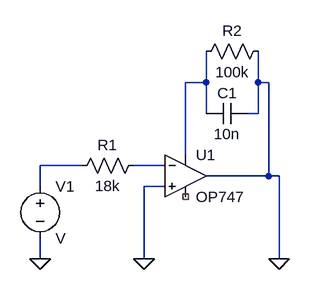
[diagram p0: schematic Draft1.asc]
Draft1.asc, the LTspice schematic file:
Version 4
SHEET 1 880 680
WIRE 480 -48 480 -96
WIRE 480 -48 448 -48
WIRE 560 -48 560 -96
WIRE 576 -48 560 -48
WIRE 480 0 480 -48
WIRE 560 0 560 -48
WIRE 560 0 544 0
WIRE 448 64 448 -48
WIRE 288 80 224 80
WIRE 416 80 368 80
WIRE 576 96 576 -48
WIRE 576 96 480 96
WIRE 592 96 576 96
WIRE 224 112 224 80
WIRE 416 112 384 112
WIRE 224 224 224 192
WIRE 384 224 384 112
WIRE 592 224 592 96
FLAG 224 224 0
FLAG 384 224 0
FLAG 592 224 0
SYMBOL voltage 224 96 R0
SYMATTR InstName V1
SYMBOL res 384 64 R90
WINDOW 0 0 56 VBottom 2
WINDOW 3 32 56 VTop 2
SYMATTR InstName R1
SYMATTR Value 18k
SYMBOL Opamps\\OP747 448 32 R0
SYMATTR InstName U1
SYMBOL cap 544 -16 R90
WINDOW 0 0 32 VBottom 2
WINDOW 3 32 32 VTop 2
SYMATTR InstName C1
SYMATTR Value 10n
SYMBOL res 576 -112 R90
WINDOW 0 0 56 VBottom 2
WINDOW 3 32 56 VTop 2
SYMATTR InstName R2
SYMATTR Value 100k

The netlist it stands for:
* Draft1.asc
V1 N002 0 V
R1 N003 N002 18k
XU1 0 N003 N001 NC_01 0 OP747  ; pins In+ In- V+ V- OUT
C1 0 N001 10n
R2 0 N001 100k
.backanno
.end